# Altium schematic sheet RS-232.SchDoc
size A
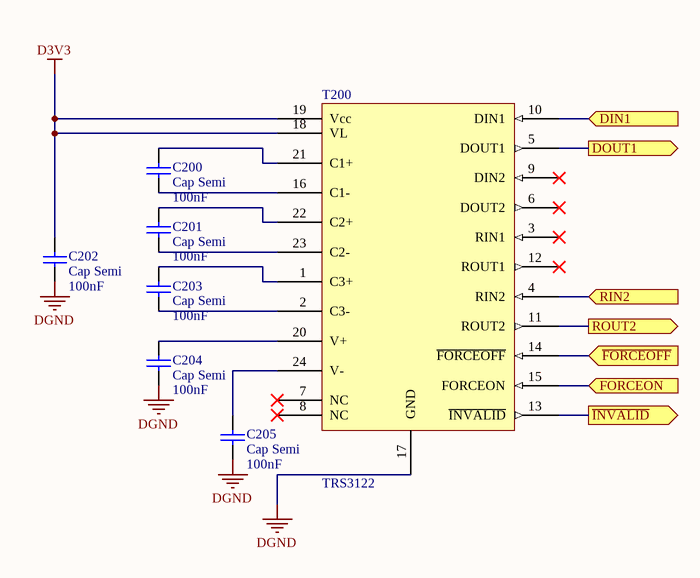
[diagram p0: RS-232.SchDoc]

## Parts
C200  Cap Semi  value 100nF  [1608[0603]]
C201  Cap Semi  value 100nF  [1608[0603]]
C202  Cap Semi  value 100nF  [1608[0603]]
C203  Cap Semi  value 100nF  [1608[0603]]
C204  Cap Semi  value 100nF  [1608[0603]]
C205  Cap Semi  value 100nF  [1608[0603]]
T200  TRS3122  [QFN50P485X485X100_HS-25N]

## Ports
DIN1 (in), DOUT1 (out), FORCEON (in), RIN2 (in), ROUT2 (out), ~{FORCEOFF} (in), ~{INVALID} (out)

## Nets
D3V3: C202.1 T200.18(VL) T200.19(Vcc)
DGND: C202.2 C204.2 C205.2 T200.17(GND)
DIN1: T200.10(DIN1) ; port DIN1
DOUT1: T200.5(DOUT1) ; port DOUT1
~{FORCEOFF}: T200.14(~{FORCEOFF}) ; port ~{FORCEOFF}
FORCEON: T200.15(FORCEON) ; port FORCEON
~{INVALID}: T200.13(~{INVALID}) ; port ~{INVALID}
RIN2: T200.4(RIN2) ; port RIN2
ROUT2: T200.11(ROUT2) ; port ROUT2
NetC200_1: C200.1 T200.21(C1+)
NetC200_2: C200.2 T200.16(C1-)
NetC201_1: C201.1 T200.22(C2+)
NetC201_2: C201.2 T200.23(C2-)
NetC203_1: C203.1 T200.1(C3+)
NetC203_2: C203.2 T200.2(C3-)
NetC204_1: C204.1 T200.20(V+)
NetC205_1: C205.1 T200.24(V-)

Not connected (* = marked no-connect by the designer): T200 3(RIN1)* 6(DOUT2)* 7(NC)* 8(NC)* 9(DIN2)* 12(ROUT1)*

## Library data of the parts
C200-C205 = Cap Semi: Capacitor (Semiconductor SIM Model); PartNumber: CC0603JRX7R7BB104; Published: 8-Jun-2000; LatestRevisionDate: 29-May-2009; LatestRevisionNote: IPC-7351 Footprint Added.; PackageReference: C1206; Publisher: Altium Limited; PackageDescription: Chip Capacitor
  C200: DatasheetVersion: http://www.ti.com/lit/ds/symlink/trs3122e.pdf
T200 = Component_1: PartNumber: TRS3122ERGET